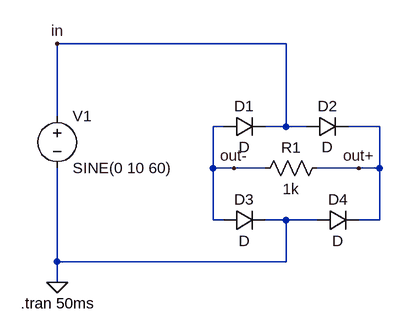
[diagram p0: schematic full-wave rectifier circuit part 2.asc]
full-wave rectifier circuit part 2.asc, the LTspice schematic file:
Version 4.1
SHEET 1 880 680
WIRE 288 -96 -64 -96
WIRE -64 16 -64 -96
WIRE 192 32 176 32
WIRE 288 32 288 -96
WIRE 288 32 256 32
WIRE 320 32 288 32
WIRE 432 32 384 32
WIRE 176 96 176 32
WIRE 208 96 176 96
WIRE 256 96 208 96
WIRE 400 96 336 96
WIRE 432 96 432 32
WIRE 432 96 400 96
WIRE 176 176 176 96
WIRE 192 176 176 176
WIRE 288 176 256 176
WIRE 336 176 288 176
WIRE 432 176 432 96
WIRE 432 176 400 176
WIRE -64 240 -64 96
WIRE 288 240 288 176
WIRE 288 240 -64 240
WIRE -64 272 -64 240
FLAG -64 272 0
FLAG 208 96 out-
FLAG 400 96 out+
FLAG -64 -96 in
SYMBOL voltage -64 0 R0
WINDOW 123 0 0 Left 0
WINDOW 39 0 0 Left 0
SYMATTR InstName V1
SYMATTR Value SINE(0 10 60)
SYMBOL diode 192 48 R270
WINDOW 0 32 32 VTop 2
WINDOW 3 0 32 VBottom 2
SYMATTR InstName D1
SYMBOL diode 320 48 R270
WINDOW 0 32 32 VTop 2
WINDOW 3 0 32 VBottom 2
SYMATTR InstName D2
SYMBOL diode 192 192 R270
WINDOW 0 32 32 VTop 2
WINDOW 3 0 32 VBottom 2
SYMATTR InstName D3
SYMBOL diode 336 192 R270
WINDOW 0 32 32 VTop 2
WINDOW 3 0 32 VBottom 2
SYMATTR InstName D4
SYMBOL res 352 80 R90
WINDOW 0 0 56 VBottom 2
WINDOW 3 32 56 VTop 2
SYMATTR InstName R1
SYMATTR Value 1k
TEXT -120 304 Left 2 !.tran 50ms

The netlist it stands for:
* full-wave rectifier circuit part 2.asc
V1 in 0 SINE(0 10 60)
D1 out- in D
D2 in out+ D
D3 out- 0 D
D4 0 out+ D
R1 out+ out- 1k
.model D D
.lib standard.dio
.tran 50ms
.backanno
.end